# Altium schematic sheet RS232.SchDoc
size Letter; SheetNumber: 6; SheetTotal: 11
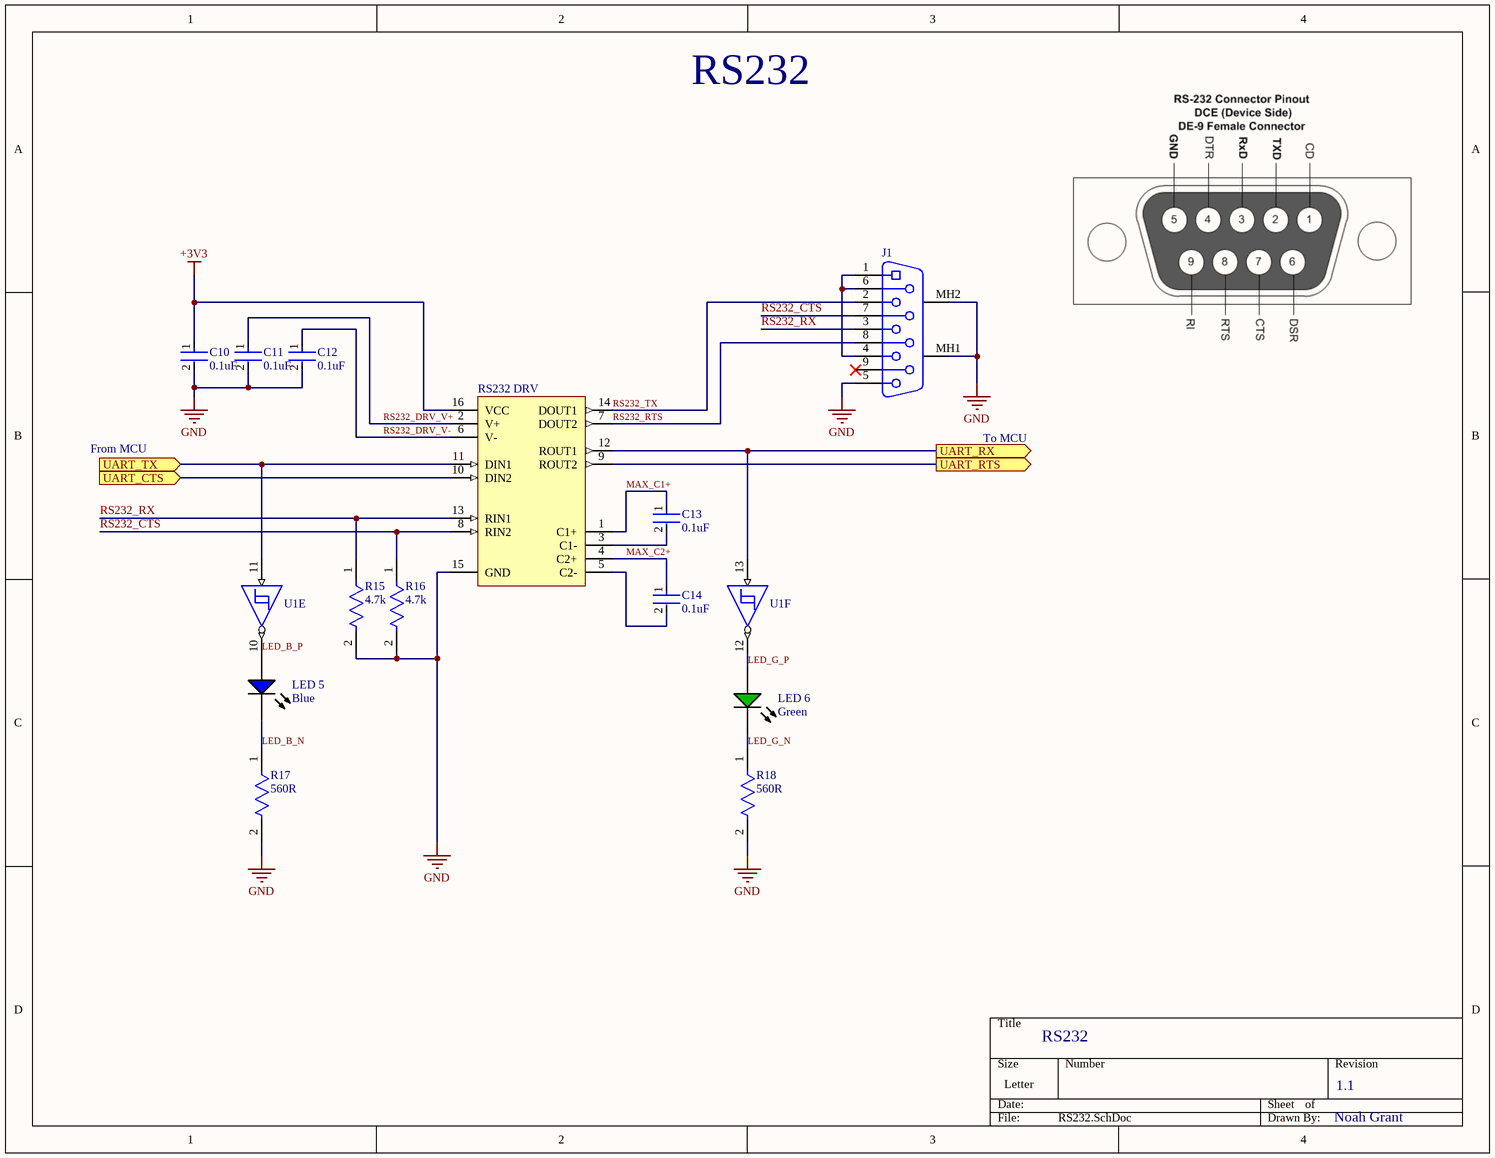
[diagram p0: RS232.SchDoc]

## Parts
C10  0.1uF  [FP-CC0603-DA-MFG]
C11  0.1uF  [FP-CC0603-DA-MFG]
C12  0.1uF  [FP-CC0603-DA-MFG]
C13  0.1uF  [FP-CC0603-DA-MFG]
C14  0.1uF  [FP-CC0603-DA-MFG]
J1  2311765-1  [TECO-2311765-1_V]  (value not drawn)
LED_5  Blue  [AVAG-HSMX-C190_V]
LED_6  Green  [AVAG-HSMX-C190_V]
R15  4.7k  [FP-CRCW0603-e3-IPC_A]
R16  4.7k  [FP-CRCW0603-e3-IPC_A]
R17  560R  [FP-CPF0603-MFG]
R18  560R  [FP-CPF0603-MFG]
RS232_DRV  MAX3232CDR  [D0016A_L]  (value not drawn)
U1  SN74HC14PWT  [PW0014A_M]  (value not drawn)  (parts E,F of 7)

## Ports
UART_CTS (in, see Top_Sheet[4B], Nucleo[4C]), UART_RTS (out, see Top_Sheet[4B], Nucleo[4C]), UART_RX (out, see Top_Sheet[4B], Nucleo[4C]), UART_TX (in, see Top_Sheet[4B], Nucleo[3C])

## Nets
+3V3: C10.1 RS232_DRV.16(VCC)
GND: C10.2 C11.2 C12.2 J1.5 J1.MH1 J1.MH2 R15.2 R16.2 R17.2 R18.2 RS232_DRV.15(GND)
LED_B_N: LED_5.2(K) R17.1
LED_B_P: LED_5.1(A) U1.10(~{5Y})
LED_G_N: LED_6.2(K) R18.1
LED_G_P: LED_6.1(A) U1.12(~{6Y})
MAX_C1+: C13.1 RS232_DRV.1(C1+)
MAX_C2+: C14.1 RS232_DRV.4(C2+)
RS232_CTS: J1.7 R16.1 RS232_DRV.8(RIN2)
RS232_DRV_V+: C11.1 RS232_DRV.2(V+)
RS232_DRV_V-: C12.1 RS232_DRV.6(V-)
RS232_RTS: J1.8 RS232_DRV.7(DOUT2)
RS232_RX: J1.3 R15.1 RS232_DRV.13(RIN1)
RS232_TX: J1.2 RS232_DRV.14(DOUT1)
UART_CTS: RS232_DRV.10(DIN2) ; port UART_CTS
UART_RTS: RS232_DRV.9(ROUT2) ; port UART_RTS
UART_RX: RS232_DRV.12(ROUT1) U1.13(6A) ; port UART_RX
UART_TX: RS232_DRV.11(DIN1) U1.11(5A) ; port UART_TX
NetC13_2: C13.2 RS232_DRV.3(C1-)
NetC14_2: C14.2 RS232_DRV.5(C2-)
NetJ1_1: J1.1 J1.4 J1.6

Not connected (* = marked no-connect by the designer): J1 9*

## Notes on the sheet
- RS232
- From MCU
- To MCU
- 1.1
- Noah Grant

## Library data of the parts
C10-C14 = CMP-03422-000468-1: CAP CER 0.1UF 50V X7R 0603; Manufacturer: YAGEO; Manufacturer Part Number: CC0603KPX7R9BB104; Temperature Coefficient: 15%; Capacitance: 100 nF; Material: Ceramic; Value: 100 nF; Tolerance: 0.1; Device Class L1: Passive Components; Temperature Range High: +125°C; ComponentLink2Description: Datasheet; Temperature Characteristic: X7R; Octopart: https://octopart.com/cc0603kpx7r9bb104-yageo-12885113; Height: 0.9mm; Mouser Description: Multilayer Ceramic Capacitors MLCC - SMD/SMT 100nF 50V X7R 10%; Device Class L3: Ceramic Capacitors; Voltage Rating: 50 V; Device Class L2: Capacitors; ComponentLink2URL: http://www.yageo.com/documents/recent/UPY-GPHC_X7R_6.3V-to-50V_18.pdf; Package: CC0603-DA; Automotive: No; Voltage: 50 V; RoHS: TRUE; Lead Free: Yes; Digikey Description: CAP CER 0.1UF 50V X7R 0603; Footprint Url: http://www.yageo.com/exep/pages/download/literatures/UPY-C_GEN_24.pdf; Temperature Range Low: -55°C; Temperature: -55°C to +125°C; Category: Cap
J1 = CMP-2000-07623-1: D-Sub Receptacle, Pitch 2.77 mm, 1 x 9 Position, Height 12.55 mm, -55 to 105 degC, RoHS; Manufacturer: TEConnectivity; Package Description: D-Sub Receptacle, Pitch 2.77 mm, 1 x 9 Position, Height 12.55 mm; Package Reference: 2311765-1; Manufacturer URL: http://www.te.com/; Datasheet URL: http://www.te.com/commerce/DocumentDelivery/DDEController?Action=showdoc&DocId=Customer+Drawing%7F2311765%7FB%7Fpdf%7FEnglish%7FENG_CD_2311765_B.pdf%7F2311765-1; Datasheet Version: Rev. B, 10/2017; Mounting Technology: ThroughHole
LED_5 = CMP-1744-00007-1: LED Uni-Color Blue, 78 mW, 20 mA, -40 to 85 degC, 2-Pin SMD, RoHS, Tape and Reel; Rds On Max: 10 Ohm; Nominal Vgs: -1.7 V; Max Power Dissipation: 360 mW; Elements: 1; Case\Package: TO-236-3; Input Capacitance: 73 pF; Typical Rise Time: 6.3 ns; Nominal Dual Supply Voltage: -50 V; Packaging: Tape and Reel; Height: 0.93 mm; Mount: Surface Mount; RoHSCompliant: true; DatasheetVersion: Apr-10; REACH SVHC: No SVHC; ComponentLink1URL: http://www.avagotech.com/; Radiation Hardening: No; ComponentLink3Description: Package Specification; ComponentLink3URL: http://www.fairchildsemi.com/dwg/MA/MA03D.pdf; ComponentLink2Description: Datasheet; PackageDescription: 2-Pin Surface Mount Device, Body 1.6 x 0.8 mm, Height 0.9 mm; Package Quantity: 3000; PackageReference: HSMX-C190; ComponentLink1Description: Manufacturer URL; Pins: 3; Length: 2.92 mm; ComponentLink2URL: http://docs.avagotech.com/docs/AV02-0977EN; Min Operating Temperature: -55 degC; Width: 1.3 mm; Max Operating Temperature: 150 degC
LED_6 = CMP-1744-00002-1: Chip LED, Green, 2.2 V, -40 to 85 degC, 2-Pin SMD, RoHS, Tape and Reel; Frequency: 400 KHz; Max Supply Voltage: 5.5 V; Access Time: 3500 ns; Clock Frequency: 100 KHz; Case\Package: SOIC; Density: 32 kb; Nominal Supply Current: 2 mA; Interface: Serial; Min Supply Voltage: 1.7 V; Packaging: Tape and Reel; PackageReference: HSMX-C190; ComponentLink2URL: http://docs.avagotech.com/docs/AV02-0551EN; RoHSCompliant: true; Pins: 8; REACH SVHC: No SVHC; Max Operating Temperature: 85 degC; Width: 4 mm; Radiation Hardening: No; Package Quantity: 3000; ComponentLink3Description: Package Specification; ComponentLink1Description: Manufacturer URL; Min Operating Temperature: -40 degC; PackageDescription: 2-Pin Surface Mount Device, Body 1.6 x 0.8 mm, Height 0.9 mm; Max Clock Frequency: 100 KHz; Height: 1.5 mm; ComponentLink1URL: http://www.avagotech.com/; DatasheetVersion: Mar-12; ComponentLink2Description: Datasheet; Mount: Surface Mount; Length: 5 mm; ComponentLink3URL: http://www.fairchildsemi.com/dwg/MA/MA03D.pdf
R15 R16 = CMP-1666-00019-3: RES Thick Film, 4.7kΩ, 1%, 0.1W, 100ppm/°C, 0603; Resistance: 4.7kR; Voltage Rating: 75V; Power Rating: 100mW; Case Code (Metric): 1608; Military Standard: Not; Packaging: Tape and Reel; Termination: SMD/SMT; Temperature Coefficient: 100ppm/°C; Lead Free: Lead Free; Length: 1.55mm; Width: 0.85mm; Height: 0.45mm; Depth: 0.85mm; Weight: 7.1E-05oz; Case Code (Imperial): 0603; Contact Plating: Tin; Case/Package: 0603; Max Operating Temperature: 155°C; Mount: Surface Mount; Tolerance: 1%; Min Operating Temperature: -55°C; Package Quantity: 5000; Voltage Rating (DC): 75V; Composition: Thick Film
R17 R18 = CMP-03211-007342-1: RES SMD 560Ω 0.1% 1/16W 0603; Manufacturer Part Number: CPF0603B560RE1; Manufacturer: TE Connectivity; Temperature Coefficient: 25ppm/°C; Voltage Rating: 50V; Power Rating: 0.063W; Lead Free: Yes; Automotive: No; Octopart: https://octopart.com/cpf0603b560re1-te+connectivity-9539416; Temperature Range High: +155°C; Device Class L2: Resistors; Temperature Range Low: -55°C; Composition: Thin Film; RoHS: TRUE; ComponentLink2URL: https://www.te.com/commerce/DocumentDelivery/DDEController?Action=showdoc&DocId=Data+Sheet%7F1773200%7FM%7Fpdf%7FEnglish%7FENG_DS_1773200_M.pdf%7F3-1676481-2; Temperature: -55°C to +155°C; Device Class L1: Passive Components; Resistance: 560Ω; Height: 0.55mm; Series: CPF; octopart_url: https://octopart.com/cpf0603b560re1-te+connectivity-9539416; Category: Res; Tolerance: 0.1%; ComponentLink2Description: Datasheet; packaging: 1k Reel; Package: CPF0603; Device Class L3: Chip SMD Resistors; Value: 560Ω; Ipc Land Pattern Name: RESC15580X45
RS232_DRV = CMP-0299-00399-2: 3-V to 5.5-V Multichannel RS-232 Line Driver / Receiver with ±15-kV ESD Protection, 0 to 70 degC, 16-Pin SOIC (D), Green (RoHS & no Sb/Br); Receivers Per Package: 2; ESD HBM(kV): +/-15; ICC(Max)(mA): 1; Supply Voltage(s)(V): 3.3 or 5.0; Single Supply: TRUE; ComponentLink1URL: www.ti.com; ComponentLink3URL: http://www.ti.com/litv/pdf/mpds178g; PackageReference: D0016A; ComponentLink2Description: Datasheet; ComponentLink2URL: http://www.ti.com/general/docs/lit/getliterature.tsp?genericPartNumber=MAX3232&fileType=pdf; ComponentLink1Description: Manufacturer URL; PackageDescription: 16-Pin Plastic Small Outline Integrated Circuit, 9.9 x 3.9 mm, Pitch 1.27 mm Pitch; PackageVersion: revM, Jun-2011; Drivers Per Package: 2; SubFamily: RS-232; DatasheetVersion: SLLS410I; ComponentLink3Description: Package Specification; RS-232: TRUE
U1 = CMP-1615-00108-4: Hex Schmitt-Trigger Inverters, PW0014A, SMALL T&R; Manufacturer: Texas Instruments; F @ Nom Voltage(Max)(Mhz): 20; Input Type: CMOS; VCC(Min)(V): 2; Bits(#): 6; Output Drive (IOL/IOH)(Max)(mA): -4/4; Technology Family: HC; Rating: Catalog; Voltage(Nom)(V): 5; ICC @ Nom Voltage(Max)(mA): 0.02; Schmitt Trigger: Yes; tpd @ Nom Voltage(Max)(ns): 31; Operating Temperature Range(C): -40 to 85; Output Type: CMOS; DatasheetVersion: SCLS085G; Generic Part Number: SN74HC14; VCC(Max)(V): 6; Code_JEDEC: MO-153; PackageReference: PW0014A